# Altium project PCB_PowerOutPut.PrjPCB
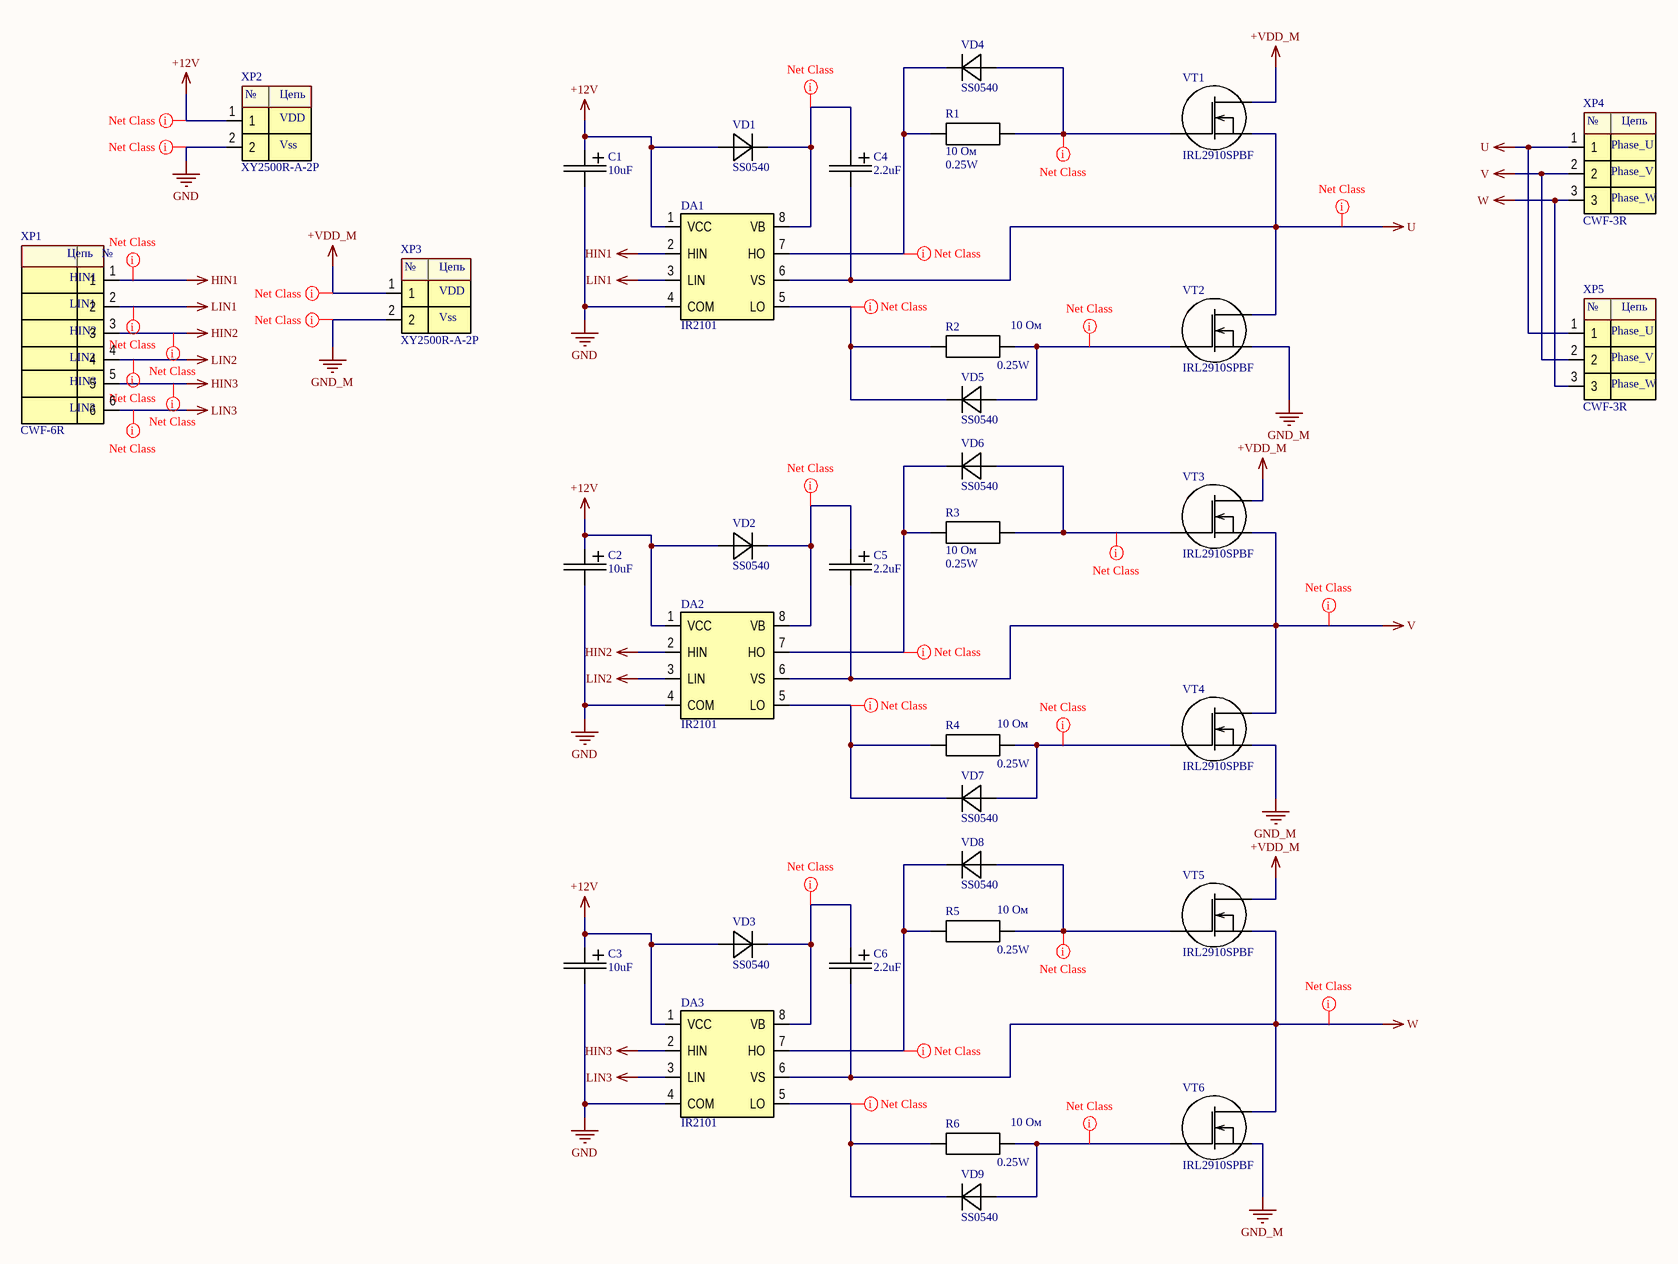
[diagram p0: Sheme_PowerOutPut.SchDoc]
1 sheet, 35 parts. Net scope: global (net labels, ports and power ports of the same name join across sheets).
Board file: PCB_DriveSwitch_rev1_05062018.PcbDoc

## Sheet Sheme_PowerOutPut.SchDoc
size 420 x 297 mm; Address1: Address1; Address2: Address2; Address3: Address3; Address4: Address4; SheetNumber: 1; Scale: 1:1; Разраб.: Лепотенко; Обозначение документа: ЛАС.424542.001 Э3; Перв. применение: ЛАС.424542.001 Э3; Наименование изделия 1: Драйвер ключей BLDC; Наименование изделия 2: Схема электрическая; Наименование изделия 3: принципиальная; Нач. отд.: Нач. отд.

### Parts
C1  10uF  [CAPTtantaltypeA]
C2  10uF  [CAPTtantaltypeA]
C3  10uF  [CAPTtantaltypeA]
C4  2.2uF  [CAPTtantaltypeA]
C5  2.2uF  [CAPTtantaltypeA]
C6  2.2uF  [CAPTtantaltypeA]
DA1  IR2101  [SO-8]
DA2  IR2101  [SO-8]
DA3  IR2101  [SO-8]
R1  Power: 0.25W  [1206]  (hidden comment: 10 Ом)
R2  Power: 0.25W  [1206]  (hidden comment: 10 Ом)
R3  Power: 0.25W  [1206]  (hidden comment: 10 Ом)
R4  Power: 0.25W  [1206]  (hidden comment: 10 Ом)
R5  Power: 0.25W  [1206]  (hidden comment: 10 Ом)
R6  Power: 0.25W  [1206]  (hidden comment: 10 Ом)
VD1  SS0540  [SOD-123]
VD2  SS0540  [SOD-123]
VD3  SS0540  [SOD-123]
VD4  SS0540  [SOD-123]
VD5  SS0540  [SOD-123]
VD6  SS0540  [SOD-123]
VD7  SS0540  [SOD-123]
VD8  SS0540  [SOD-123]
VD9  SS0540  [SOD-123]
VT1  IRL2910SPBF  [D2PACK]
VT2  IRL2910SPBF  [D2PACK]
VT3  IRL2910SPBF  [D2PACK]
VT4  IRL2910SPBF  [D2PACK]
VT5  IRL2910SPBF  [D2PACK]
VT6  IRL2910SPBF  [D2PACK]
XP1  CWF-6R  [CWF-6R]
XP2  XY2500R-A-2P  [KLS2-EDR-500-2P]
XP3  XY2500R-A-2P  [KLS2-EDR-500-2P]
XP4  CWF-3R  [CWF-3R]
XP5  CWF-3R  [CWF-3R]

### Nets
+12V: C1.1 C2.1 C3.1 DA1.1(VCC) DA2.1(VCC) DA3.1(VCC) VD1.1 VD2.1 VD3.1 XP2.1
+VDD_M: VT1.2(D) VT3.2(D) VT5.2(D) XP3.1
GND: C1.2 C2.2 C3.2 DA1.4(COM) DA2.4(COM) DA3.4(COM) XP2.2
GND_M: VT2.3(Source) VT4.3(Source) VT6.3(Source) XP3.2
HIN1: DA1.2(HIN) XP1.1
HIN2: DA2.2(HIN) XP1.3
HIN3: DA3.2(HIN) XP1.5
LIN1: DA1.3(LIN) XP1.2
LIN2: DA2.3(LIN) XP1.4
LIN3: DA3.3(LIN) XP1.6
U: C4.2 DA1.6(VS) VT1.3(Source) VT2.2(D) XP4.1 XP5.1
V: C5.2 DA2.6(VS) VT3.3(Source) VT4.2(D) XP4.2 XP5.2
W: C6.2 DA3.6(VS) VT5.3(Source) VT6.2(D) XP4.3 XP5.3
NetC4_1: C4.1 DA1.8(VB) VD1.2
NetC5_1: C5.1 DA2.8(VB) VD2.2
NetC6_1: C6.1 DA3.8(VB) VD3.2
NetDA1_5: DA1.5(LO) R2.1 VD5.2
NetDA1_7: DA1.7(HO) R1.1 VD4.2
NetDA2_5: DA2.5(LO) R4.1 VD7.2
NetDA2_7: DA2.7(HO) R3.1 VD6.2
NetDA3_5: DA3.5(LO) R6.1 VD9.2
NetDA3_7: DA3.7(HO) R5.1 VD8.2
NetR1_2: R1.2 VD4.1 VT1.1(G)
NetR2_2: R2.2 VD5.1 VT2.1(G)
NetR3_2: R3.2 VD6.1 VT3.1(G)
NetR4_2: R4.2 VD7.1 VT4.1(G)
NetR5_2: R5.2 VD8.1 VT5.1(G)
NetR6_2: R6.2 VD9.1 VT6.1(G)

### Layout directives
net class PowerControl: +12V, GND
net class SignalInput: HIN1, HIN2, HIN3, LIN1, LIN2, LIN3
net class PowerOut: +VDD_M, GND_M
net class OUTPUTSignalPhase: U, V, W
net class c_strapp: NetC4_1, NetC5_1, NetC6_1
net class C_controlGate: NetDA1_5, NetDA1_7, NetDA2_5, NetDA2_7, NetDA3_5, NetDA3_7, NetR1_2, NetR2_2, NetR3_2, NetR4_2, NetR5_2, NetR6_2

### Notes on the sheet
- Перв. примен.
- Справ. №
- Подп. и дата
- Инв. № дубл.
- Взам. инв. №
- Разраб.
- Изм.
- Лист
- № докум.
- Подп.
- Дата
- Лит.
- Масса
- Масштаб
- Пров.
- Т.контр.
- Листов
- Инв. № подл.
- Утв.
- Н.контр.
- Копировал
- Формат А3
- (in symbol Connector_Power) №; Цепь; VDD; Vss
- (in symbol CWF-3R) №; Цепь; Phase_U; Phase_V; Phase_W
- (in symbol CWF-6R) Цепь; №; HIN1; LIN1; HIN2; LIN2; HIN3; LIN3

### Library data of the parts
C1-C6 = Capasitor Electrolit: Part Number: TA2u2; Manufacturer: Samsung; Power: 16V; Price: 0.105; ShoppingPlace: http://belchip.by/product/?selected_product=03141; Package: typeA
  C1-C3: Value: 10uF
  C4-C6: Value: 2.2uF
DA1-DA3 = IR2101: Part Number: IR2101SPBF; Manufacture: Infineon; Package: SO-8; Price: 1.27; Quantity: 3; ShoppingPlace: http://belchip.by/product/?selected_product=06498
R1-R6 = Resistor: Manufacturer: YAGEO; Part Number: RC1206JR-0710RL; Quntity: 6; Price: 0.15; Package: 1206; ShoppingPlace: http://belchip.by/product/?selected_product=30320; Value: 10 Ом
VD1-VD9 = SS0540: Manufacturer: DC Components; part Number: SS0540; Package: SOD-123; Quantity: 1; Price: 0.17; ShoppingPlace: http://belchip.by/product/?selected_product=15760
VT1-VT6 = IRL2910SPBF: Manufacturer: International rectifier; Value: 55А, 100В; Price: 2.40; ShoppingPlace: http://belchip.by/product/?selected_product=06731; Package: D2PАK; Quantity: 6; Part Number: IRL2910SPBF
XP1 = CWF-6R: Manufacturer: KLS; Part Number: CWF-6R; Quantity: 1; Price: 1; shoppingPlace: http://belchip.by/product/?selected_product=32444; Package: CWF-6R
XP2 XP3 = Connector_Power: Manufacturer: RoB; Package: XY2500R-A-2P; Part Number: XY2500R-A-2P; Quantity: 1; Price: 0.1; ShoppingPlace: http://belchip.by/product/?selected_product=14514
XP4 XP5 = CWF-3R: Manufacturer: KLS; Package: CWF-3R; Part Number: CWF-3R; Value: *; Quantity: 3; Price: 0.05; ShoppingPlace: http://belchip.by/product/?selected_product=32444